# EAGLE design Dram (EAGLE 9.6.1)
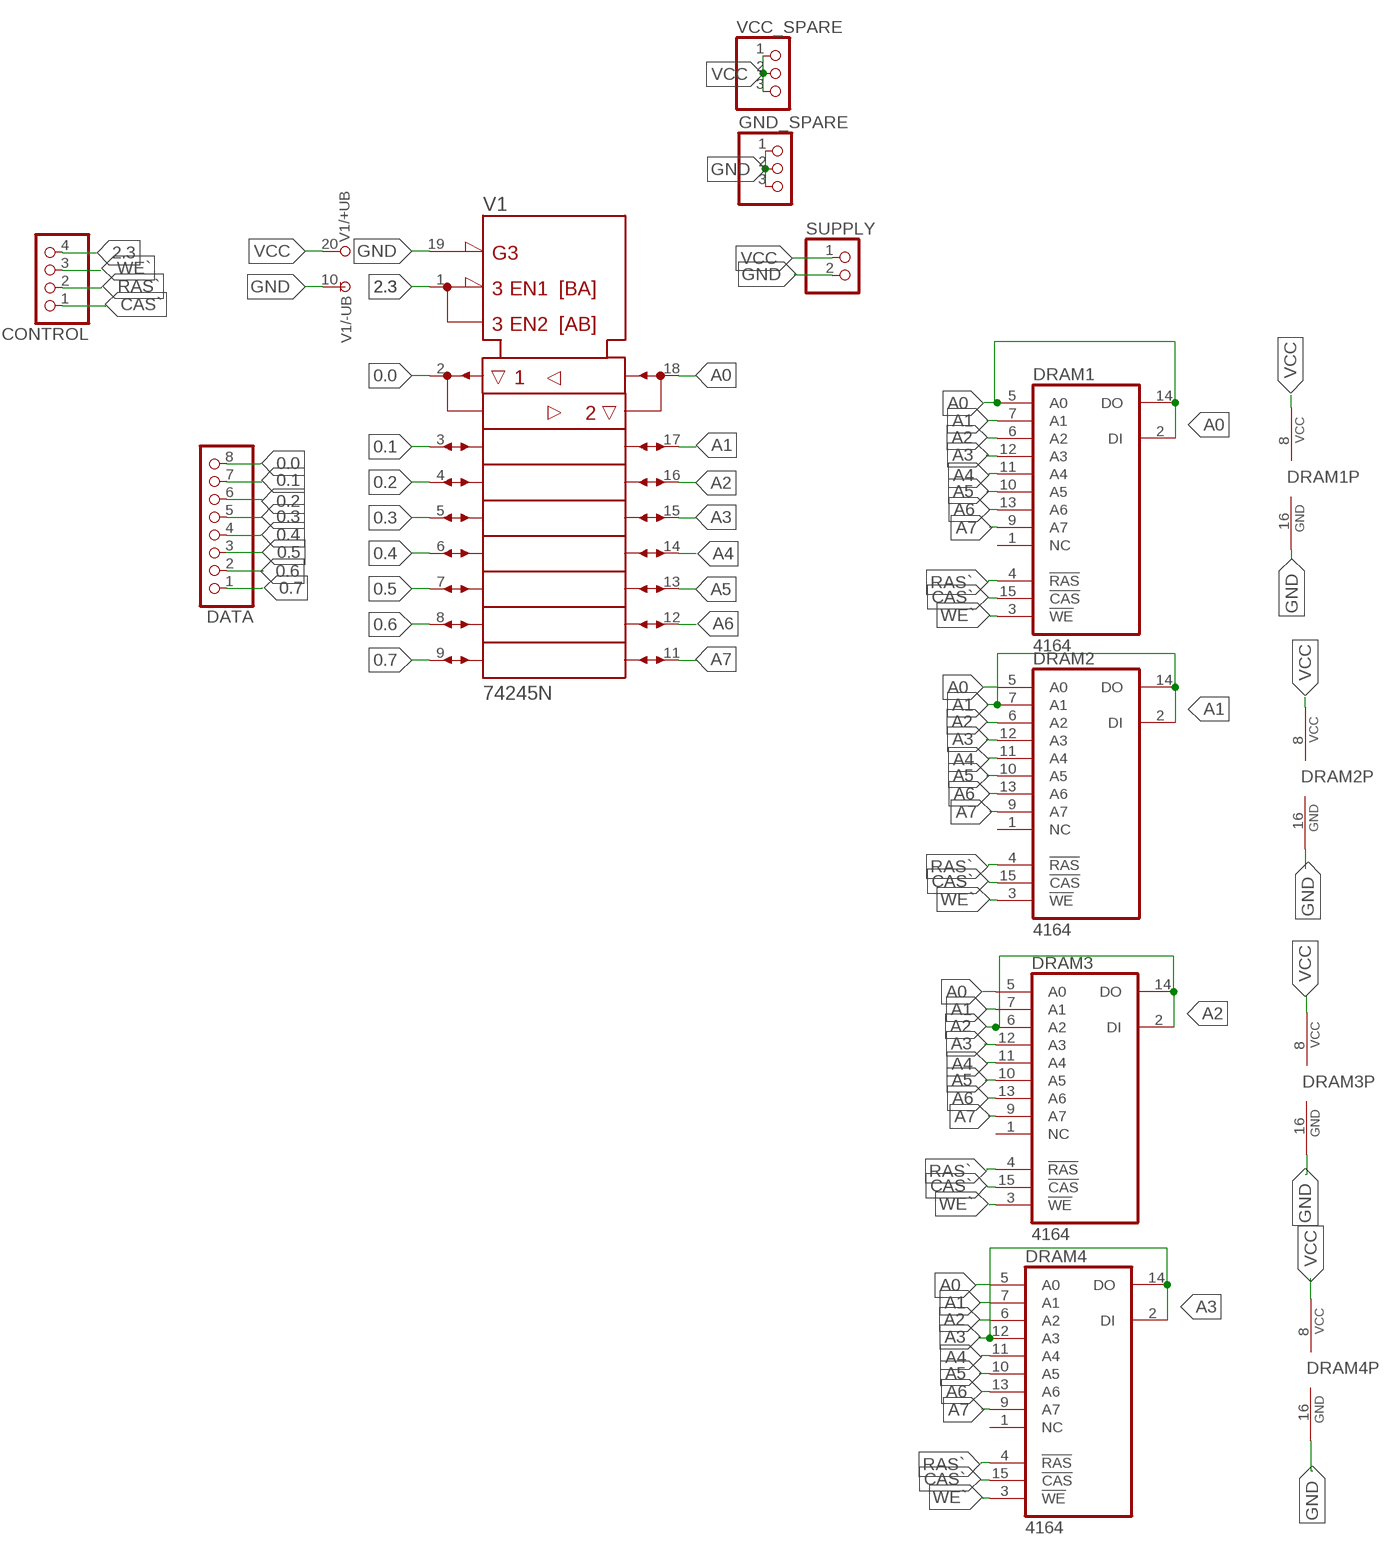
[diagram p0: schematic, sheet 1]

## Parts
CONTROL  PINHD-1X4  [1X04]
DATA  PINHD-1X8  [1X08]
DRAM1  4164  [DIP762W53P254L1969H508Q16B]
DRAM2  4164  [DIP762W53P254L1969H508Q16B]
DRAM3  4164  [DIP762W53P254L1969H508Q16B]
DRAM4  4164  [DIP762W53P254L1969H508Q16B]
GND_SPARE  PINHD-1X3  [1X03]
SUPPLY  PINHD-1X2  [1X02]
V1  74245N  [DIL20]
VCC_SPARE  PINHD-1X3  [1X03]

## Nets
0.0: DATA.8 V1.2(A1)
0.1: DATA.7 V1.3(A2)
0.2: DATA.6 V1.4(A3)
0.3: DATA.5 V1.5(A4)
0.4: DATA.4 V1.6(A5)
0.5: DATA.3 V1.7(A6)
0.6: DATA.2 V1.8(A7)
0.7: DATA.1 V1.9(A8)
2.3: CONTROL.4 V1.1(DIR)
A0: DRAM1.2(DI) DRAM1.5(A0) DRAM1.14(DO) DRAM2.5(A0) DRAM3.5(A0) DRAM4.5(A0) V1.18(B1)
A1: DRAM1.7(A1) DRAM2.2(DI) DRAM2.7(A1) DRAM2.14(DO) DRAM3.7(A1) DRAM4.7(A1) V1.17(B2)
A2: DRAM1.6(A2) DRAM2.6(A2) DRAM3.2(DI) DRAM3.6(A2) DRAM3.14(DO) DRAM4.6(A2) V1.16(B3)
A3: DRAM1.12(A3) DRAM2.12(A3) DRAM3.12(A3) DRAM4.2(DI) DRAM4.12(A3) DRAM4.14(DO) V1.15(B4)
A4: DRAM1.11(A4) DRAM2.11(A4) DRAM3.11(A4) DRAM4.11(A4) V1.14(B5)
A5: DRAM1.10(A5) DRAM2.10(A5) DRAM3.10(A5) DRAM4.10(A5) V1.13(B6)
A6: DRAM1.13(A6) DRAM2.13(A6) DRAM3.13(A6) DRAM4.13(A6) V1.12(B7)
A7: DRAM1.9(A7) DRAM2.9(A7) DRAM3.9(A7) DRAM4.9(A7) V1.11(B8)
CAS`: CONTROL.1 DRAM1.15(!CAS) DRAM2.15(!CAS) DRAM3.15(!CAS) DRAM4.15(!CAS)
GND: DRAM1.16(GND) DRAM2.16(GND) DRAM3.16(GND) DRAM4.16(GND) GND_SPARE.1 GND_SPARE.2 GND_SPARE.3 SUPPLY.2 V1.10(-UB) V1.19(!G)
RAS`: CONTROL.2 DRAM1.4(!RAS) DRAM2.4(!RAS) DRAM3.4(!RAS) DRAM4.4(!RAS)
VCC: DRAM1.8(VCC) DRAM2.8(VCC) DRAM3.8(VCC) DRAM4.8(VCC) SUPPLY.1 V1.20(+UB) VCC_SPARE.1 VCC_SPARE.2 VCC_SPARE.3
WE`: CONTROL.3 DRAM1.3(!WE) DRAM2.3(!WE) DRAM3.3(!WE) DRAM4.3(!WE)
Unconnected: DRAM1.1(NC) DRAM2.1(NC) DRAM3.1(NC) DRAM4.1(NC)

## Library data of the parts
CONTROL = Pinhead_Modified:PINHD-1X4: PIN HEADER
DATA = pinhead:PINHD-1X8: PIN HEADER
DRAM1-DRAM4 = commodore-plus4:4164: 64 K x 1 DRAM
GND_SPARE VCC_SPARE = pinhead:PINHD-1X3: PIN HEADER
SUPPLY = pinhead:PINHD-1X2: PIN HEADER
V1 = 74ttl-din:74*245: Octal BUS TRANSCEIVER, 3-state

## Board
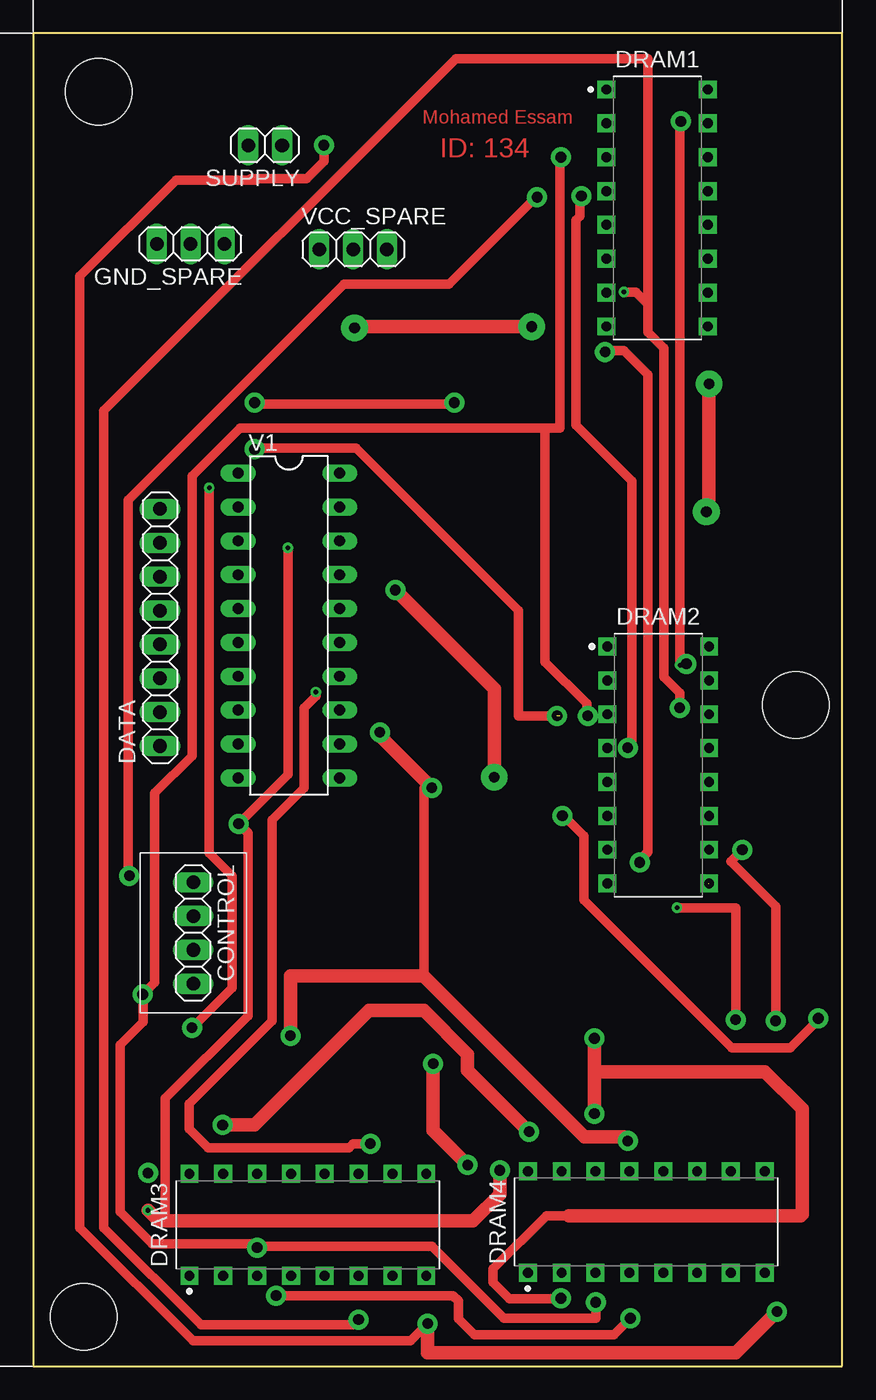
[diagram p1: board, top side]
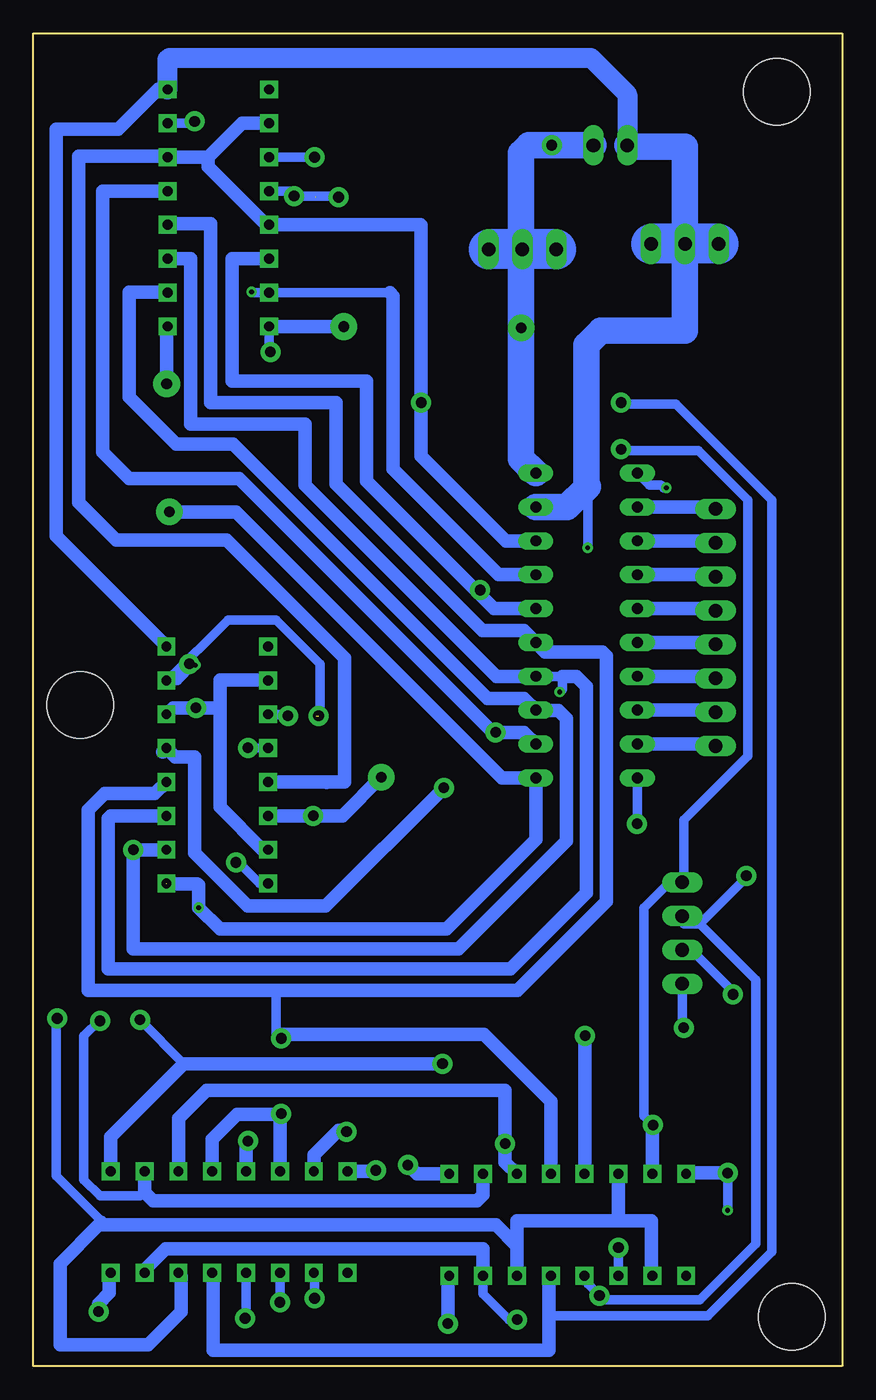
[diagram p2: board, bottom side, seen from below]

Size 60.7 x 100 mm. Coordinates in mm from the lower left corner, seen from the top.
Outline: 0,0 60.7,0 60.7,100 0,100 0,0
Copper layers (1*16): Top 0.035mm / dielectric 1.5mm / Bottom 0.035mm
Design rules "default *": minimum track width 0.7mm, minimum drill 0.35mm, track to track 0.5mm, track to pad 0.5mm, pad to pad 6mil, via to via 6mil, smd to smd 6mil, copper to edge 40mil, drill to drill 6mil, minimum pad ring 10mil, minimum via ring 8mil, stop-mask expansion 4mil, vias tented up to drill 0mil, thermal gap 10mil
Holes 5 mm at 4.9,95.6 3.8,3.7 57.2,49.6

### Footprints (pad centres in the part's own frame; a part is rotated, then mirrored left to right if it is on the bottom)
1X04 = drill 1.016 long: 1 -3.81,0; 2 -1.27,0; 3 1.27,0; 4 3.81,0
1X08 = drill 1.016 long: 1 -8.89,0; 2 -6.35,0; 3 -3.81,0; 4 -1.27,0; 5 1.27,0; 6 3.81,0; 7 6.35,0; 8 8.89,0
DIP762W53P254L1969H508Q16B = drill 0.743 pad 1.343 square: 1 -3.81,8.89; 2 -3.81,6.35; 3 -3.81,3.81; 4 -3.81,1.27; 5 -3.81,-1.27; 6 -3.81,-3.81; 7 -3.81,-6.35; 8 -3.81,-8.89; 9 3.81,-8.89; 10 3.81,-6.35; 11 3.81,-3.81; 12 3.81,-1.27; 13 3.81,1.27; 14 3.81,3.81; 15 3.81,6.35; 16 3.81,8.89
1X03 = drill 1.016 long: 1 -2.54,0; 2 0,0; 3 2.54,0
1X02 = drill 1.016 long: 1 -1.27,0; 2 1.27,0
DIL20 = drill 0.813 long: 1 -11.43,-3.81; 2 -8.89,-3.81; 3 -6.35,-3.81; 4 -3.81,-3.81; 5 -1.27,-3.81; 6 1.27,-3.81; 7 3.81,-3.81; 8 6.35,-3.81; 9 8.89,-3.81; 10 11.43,-3.81; 11 11.43,3.81; 12 8.89,3.81; 13 6.35,3.81; 14 3.81,3.81; 15 1.27,3.81; 16 -1.27,3.81; 17 -3.81,3.81; 18 -6.35,3.81; 19 -8.89,3.81; 20 -11.43,3.81

### Placement (x,y rotation side)
CONTROL  12,32.5 270 top
DATA  9.51,55.42 90 top
DRAM1  46.82,86.9 0 top
DRAM2  46.9,45.1 0 top
DRAM3  20.6,10.61 90 top
DRAM4  46,10.81 90 top
GND_SPARE  11.8,84.2 180 top
SUPPLY  17.4,91.6 180 top
V1  19.18,55.57 270 top
VCC_SPARE  24,83.8 0 top

### Tracks (layer width: path | path; a pad name or v marks a point on that pad's centre or on a via)
0.0
  Bottom 1: DATA.8 10.27,64.31 10.42,64.46 V1.2
0.1
  Bottom 1: DATA.7 10.27,61.77 10.42,61.92 V1.3
0.2
  Bottom 1: DATA.6 10.27,59.23 10.42,59.38 V1.4
0.3
  Bottom 1: DATA.5 10.27,56.69 10.42,56.84 V1.5
0.4
  Bottom 1: DATA.4 10.27,54.15 10.42,54.3 V1.6
0.5
  Bottom 1: DATA.3 10.27,51.61 10.42,51.76 V1.7
0.6
  Bottom 1: DATA.2 10.27,49.07 10.42,49.22 V1.8
0.7
  Bottom 1: DATA.1 10.27,46.53 10.42,46.68 V1.9
2.3  (via drill 0.35, 0.8 pad 1.5)
  Top 0.7: v11.9,25.4 14.9,28.4 14.9,36.8 13.2,38.5 v13.2,65.9
  Bottom 0.7: CONTROL.4 12,25.5 v11.9,25.4 | V1.1 14.47,66.1 13.6,66.1 13.4,65.9 v13.2,65.9
A0  (via drill 0.35, 0.8 pad 1.5)
  Top 0.7: v31.7,72.2 v16.7,72.2
  Bottom 0.7: v16.7,72.2 12.5,72.2 5.3,65 5.3,8.6 10.1,3.8 22,3.8 22.1,3.8 | v31.7,72.2 31.6,72.2
  Bottom 1: V1.18 25.22,61.92 31.6,68.3 31.6,72.2 v31.6,72.3 31.6,85.6 31.63,85.63 DRAM1.5 43.23,85.63 47.59,89.99 47.59,90.71 | 47.59,90.71 DRAM1.14 50.72,90.8 57.3,90.8 57.3,64.8 54.5,62 46.2,62 37.33,53.13 37.33,43.83 38.73,43.83 | DRAM1.2 45.05,93.25 47.59,90.71 | DRAM2.5 38.73,43.83 | 38.73,43.83 38.7,43.8 | DRAM4.5 47.2,6.94 47.2,1.2 22,1.2 22,3.8 22,6.67 DRAM3.5
A1  (via drill 0.35, 0.8 pad 1.5)
  Top 0.7: 46.1,79.7 46.1,77.6 47.3,76.4 47.3,51.7 48.5,50.5 v48.5,49.4 | 46.1,79.7 46.1,98.1 31.7,98.1 5.3,71.7 5.3,10.4 12.6,3.1 24,3.1 v24.4,3.5 | v44.32,80.6 45.2,80.6 46.1,79.7
  Bottom 0.7: 33.95,80.55 DRAM1.7 44.27,80.55 v44.32,80.6 | v24.4,3.5 25,3.5 26.95,5.45 DRAM3.7
  Bottom 1: V1.17 25.78,59.38 33.7,67.3 33.7,80.3 33.95,80.55 | DRAM2.7 43.51,38.75 46.7,41.94 46.7,49.4 | 46.7,49.4 46.7,51.5 43.14,51.5 DRAM2.2 | DRAM2.14 50.22,49.4 v48.5,49.4 46.7,49.4 | DRAM4.7 52.35,7.22 50.77,8.8 26.95,8.8 DRAM3.7
A2  (via drill 0.35, 0.8 pad 1.5, 0.8 pad 2)
  Top 0.7: v59,26.1 56.8,23.9 52.4,23.9 41.3,35 41.3,39.8 v39.81,41.29 v39.8,41.29
  Top 1: v34.6,44.2 34.6,50.8 v27.17,58.23
  Bottom 0.7: v59,26.1 59,14.3 55.7,11 55.6,10.8
  Bottom 1: V1.16 26.14,56.84 27.5,58.2 | DRAM1.6 45.8,83.09 45.8,73.9 35.7,73.9 35.7,66.4 27.5,58.2 | DRAM2.6 v39.8,41.29 37.51,41.29 v34.6,44.2 | v27.17,58.23 27.47,58.23 27.5,58.2 | DRAM3.6 24.41,9.01 | 24.41,9.01 24.41,10.91 16.79,10.91 | 24.41,9.01 26,10.6 55.8,10.6 | 55.6,10.8 55.8,10.6 | 55.8,10.6 58.7,7.7 58.7,1.6 52.1,1.6 49.6,4.1 49.6,6.79 DRAM4.6 | DRAM3.2 14.32,6.87 14.32,10.91 16.79,10.91 | 16.79,10.91 DRAM3.14
A3  (via drill 0.8 pad 1.5)
  Top 0.7: 40.2,11.3 38.5,11.3 34.5,7.3 34.5,6.3 35.75,5.05 39.55,5.05 v39.6,5.1
  Top 1: v42.1,24.6 42.1,22.1 | 42.1,22.1 v42.1,18.95 | 40.2,11.3 57.6,11.3 57.7,11.4 57.7,19.3 54.9,22.1 42.1,22.1
  Bottom 0.7: 42.5,28.2 42.5,24.8 v42.1,24.6 | v39.6,5.1 39.6,6.95 DRAM4.2
  Bottom 1: DRAM1.12 50.56,85.7 47.4,85.7 47.4,72.3 38,72.3 38,66.18 27,55.18 23.87,55.18 V1.15 22.29,53.6 18,53.6 17.7,53.3 17.7,34.88 24.38,28.2 42.5,28.2 56.6,28.2 56.6,41.72 55.36,42.96 51.58,42.96 DRAM2.12 | DRAM3.12 21.87,19.87 26.9,24.9 42,24.9 42.1,24.8 v42.1,24.6 | DRAM4.14 42.19,18.86 v42.1,18.95 42.15,18.9 45.4,18.9 47.27,17.03 DRAM4.12 | 39.65,5.15 v39.6,5.1
A4  (via drill 0.35, 0.8 pad 1.5)
  Top 0.7: v21.2,50.58 21.2,50.3 20.3,49.4 20.3,43.4 17.9,41 17.9,25.9 11.7,19.7 11.7,17.8 13.1,16.4 23.7,16.4 24,16.7 v25.3,16.7
  Bottom 0.7: v21.2,50.58 21,50.78 21,51.76 V1.14
  Bottom 1: V1.14 25.96,51.76 40.3,66.1 40.3,70.7 48.9,70.7 48.9,83.1 DRAM1.11 | 21,51.76 19.96,51.76 19.2,51 19.2,35.5 24.9,29.8 55.1,29.8 55.1,41.1 54.91,41.29 DRAM2.11 | DRAM4.11 49.81,18.59 47.7,20.7 25.3,20.7 v25.3,16.7 25.3,15.31 DRAM3.11
A5  (via drill 0.35, 0.8 pad 1.5)
  Top 0.7: v55.7,26 55.7,34.5 52.33,37.88 v53.2,38.75
  Bottom 0.7: v55.7,26 56.9,24.8 56.9,14 55.7,12.8 52.7,12.8 52.35,13.05
  Bottom 1: DRAM1.10 50.68,80.6 53.5,80.6 53.5,72.7 50,69.2 45.72,69.2 26.62,50.1 23.87,50.1 V1.13 22.97,49.2 21.3,49.2 20.7,48.6 20.7,39.4 28.8,31.3 53.2,31.3 v53.2,38.75 DRAM2.10 | DRAM4.10 52.35,13.05 51.7,12.4 27.4,12.4 26.95,12.85 DRAM3.10
A6  (via drill 0.8 pad 1.5)
  Top 0.7: 29.27,29.3 29.3,29.6 29.3,43.4 v29.9,43.4
  Top 1: v29.9,43.4 26,47.3 v26,47.56 | v44.6,16.9 44.3,17.2 41.38,17.2 29.27,29.3 19.3,29.3 v19.3,24.8
  Bottom 1: V1.12 23.87,47.56 v26,47.56 26.2,47.56 45.24,66.6 53.5,66.6 55.5,68.6 55.5,88.17 DRAM1.13 | 50.98,46.1 DRAM2.13 50.04,45.7 48.6,45.7 48.6,38.52 44.62,34.54 38.76,34.54 v29.9,43.4 | DRAM4.13 44.73,16.77 v44.6,16.9 | v19.3,24.8 19.3,14.45 DRAM3.13
A7  (via drill 0.35, 0.8 pad 1.5, 0.8 pad 2)  (1 unrouted)
  Top 0.7: v52.7,26 52.7,34.4 v48.3,34.4
  Top 1: v50.7,73.7 50.7,64.3 v50.5,64.1 | v30,22.7 30,17.7 v32.6,15.1
  Bottom 0.7: v52.7,26 49.4,22.7
  Bottom 1: v50.5,64.1 45.5,64.1 25.54,44.14 V1.11 22.99,39.51 29.7,32.8 46.7,32.8 v48.3,34.4 48.3,36.1 48.4,36.2 DRAM2.9 | v50.7,73.7 50.7,77.94 DRAM1.9 | DRAM4.9 54.89,17.19 54.9,17.2 49.4,22.7 v30,22.7 | v32.6,15.1 31.92,14.42 DRAM3.9
CAS`  (via drill 0.35, 0.8 pad 1.5)  (1 unrouted)
  Top 0.7: v16.7,68.6 17,68.9 24.2,68.9 36.4,56.7 36.4,48.8 v39.3,48.8 | v48.53,52.6 48.5,52.63 48.5,93.2 v48.6,93.3
  Top 1: v37.2,17.6 32.6,22.2 32.6,23.4 29.3,26.7 25.2,26.7 16.6,18.1 v14.2,18.1
  Bottom 0.7: v14.2,18.1 14.9,18.8 14.9,34.4 13.1,36.2 12.5,36.2 CONTROL.1 11.9,36.8 11.9,41 7.1,45.8 7.1,65 10.8,68.7 16.6,68.7 v16.7,68.6 | v39.3,48.8 39.2,48.9 39.2,52.7 42.5,56 46.1,56 50.65,51.45 DRAM2.15 49.88,51.45 48.73,52.6 v48.53,52.6 | DRAM1.15 48.65,93.25 v48.6,93.3
  Bottom 1: DRAM4.15 39.65,15.85 37.8,17.7 37.3,17.7 v37.2,17.6 | v14.2,18.1 14.25,18.05 DRAM3.15
  other vias: 39.5,48.8
GND  (via drill 0.35, 0.8 pad 1.5)
  Top 0.7: v19.1,61.4 19.1,44.4 v15.4,40.7 16.1,40 16.1,26.3 9.9,20.1 9.9,11.2 10.2,10.9
  Top 1: v35,14.7 35,12.9 33,10.9 10.2,10.9 9.4,10.9 v8.6,11.7
  Bottom 0.7: v15.4,40.7 15.37,40.73 V1.10 | 19.1,66 v19.1,61.4 | v8.6,14.5 v8.6,11.7
  Bottom 1: DRAM2.16 59,62.28 59,92.79 54.33,92.79 51.33,95.79 DRAM1.16 | DRAM4.16 35.08,14.62 v35,14.7 | v8.6,14.5 11.63,14.5 DRAM3.16
  Bottom 1.5: DRAM1.16 50.63,98.03 50.5,98.16 18.86,98.16 16.13,95.43 SUPPLY.2
  Bottom 2: SUPPLY.2 16.03,91.5 11.8,91.5 11.8,84.4 | 11.8,84.4 12,84.2 | V1.19 20.64,64.46 19.2,65.9 | 19.2,65.9 19.2,76.6 18.1,77.7 11.8,77.7 GND_SPARE.2 11.8,84.4 | 19.2,65.9 19.1,66
  Bottom 3: GND_SPARE.3 GND_SPARE.2 12,84.2 GND_SPARE.1
N$1  (via drill 0.8 pad 1.5)
  other vias: 8.2,27.9
N$2  (via drill 0.8 pad 1.5)
  other vias: 7.2,36.8
N$3  (via drill 0.8 pad 1.5)
  other vias: 45.5,37.8
N$4  (via drill 0.8 pad 1.5)
  other vias: 44.6,46.4
N$5  (via drill 0.8 pad 1.5)
  other vias: 41.6,48.8
N$6  (via drill 0.8 pad 1.5)
  other vias: 42.9,76.1
N$7  (via drill 0.8 pad 1.5)
  other vias: 37.8,87.7
N$8  (via drill 0.8 pad 1.5)
  other vias: 48.6,93.4
N$9  (via drill 0.8 pad 1.5)
  other vias: 16.6,72.3
N$10  (via drill 0.8 pad 1.5)
  other vias: 16.6,68.8
N$11  (via drill 0.8 pad 1.5)
  other vias: 55.7,25.9
N$12  (via drill 0.8 pad 1.5)
  other vias: 58.9,26.1
N$13  (via drill 0.8 pad 1.5)
  other vias: 49,52.7
N$14  (via drill 0.8 pad 1.5)
  other vias: 16.8,8.9
N$15  (via drill 0.8 pad 1.5)
  other vias: 39.7,41.3
RAS`  (via drill 0.35, 0.8 pad 1.5)
  Top 0.7: v7.1,36.8 7.1,65 23.3,81.2 31.2,81.2 v37.8,87.8 | v44.8,46.4 44.9,46.5 44.9,66.4 40.7,70.6 40.7,86 41,86.3 41,87.67 v41.13,87.8 | v44.8,3.6 43.55,2.35 33.1,2.35 31.9,3.55 31.9,4.9 31.5,5.3 30.54,5.3 30.51,5.27 20.85,5.27 20.82,5.3 v18.21,5.3
  Bottom 0.7: 18.21,5.31 17.9,5 10.7,5 6.5,9.2 6.5,29 10.7,33.2 | 18.21,5.31 19.1,6.2 DRAM3.4 | 10.7,33.2 11.9,33.2 CONTROL.2 | v7.1,36.8 10.7,33.2 | v37.8,87.8 v41.13,87.8 41.5,88.17 DRAM1.4 | DRAM2.4 44.77,46.37 v44.8,46.4 | DRAM4.4 44.73,3.67 v44.8,3.6 | v18.21,5.3 18.21,5.31
VCC  (via drill 0.35, 0.8 pad 1.5, 0.8 pad 2)
  Top 0.7: 16.7,89 16.2,89 | 16.2,89 10.7,89 3.5,81.8 3.5,10.4 12,1.9 28.3,1.9 v29.6,3.2 | v43,76.2 44.3,76.2 46.1,74.4 46.1,38.6 v45.3,37.8 | 16.2,89 16.3,89.1 20.5,89.1 21.8,90.4 v21.8,91.6
  Top 1: v37.4,78 24.2,78 v24.1,77.9 | v29.6,3.2 29.6,1 52.7,1 v55.8,4.1
  Bottom 0.7: 24.1,84.8 23.9,84.8 VCC_SPARE.2 | DRAM1.8 v43.01,76.21 v43,76.2 | DRAM2.8 43.71,36.21 v45.3,37.8
  Bottom 1: DRAM1.8 v37.41,78.01 v37.4,78 | v29.6,3.2 29.6,6.69 DRAM3.8 | v55.8,4.1 55.8,4.7 54.99,5.51 54.99,6.9 DRAM4.8
  Bottom 2: SUPPLY.1 v21.8,91.6 23.5,91.6 24.1,91 24.1,84.8 24.1,84.4 | V1.20 24.1,68.11 v24.1,77.9 24.1,83.8
  Bottom 3: VCC_SPARE.1 VCC_SPARE.2 24.1,83.8 VCC_SPARE.3
WE`  (via drill 0.35, 0.8 pad 1.5)  (1 unrouted)
  Top 0.7: 39.5,87.7 39.5,70.4 38.4,70.4 | 38.4,70.4 15.5,70.4 11.9,66.8 11.9,45.8 9.1,43 9.1,28.8 v8.25,27.95 8.25,25.85 6.5,24.1 6.5,11.6 8.9,9.2 16.6,9.2 v16.8,9 29.9,9 35.3,3.6 42.2,3.6 v42.2,4.8 | v41.5,48.9 41.53,48.93 41.53,49.71 38.4,52.84 38.4,70.4 | v39.6,90.7 39.53,90.63 39.53,87.7
  Bottom 0.7: DRAM3.3 v16.79,9 v16.8,9 | DRAM2.3 v41.51,48.91 v41.5,48.9 | v39.6,90.7 v39.61,90.71 DRAM1.3 | v42.2,4.8 v42.19,4.81 DRAM4.3 | CONTROL.3 11.33,31.23 8.25,28.15 v8.25,27.95

### Text on the board
Top: Mohamed Essam | ID: 134